# EAGLE design Electronic Sculpture PCB rev1 (EAGLE 9.6.2)
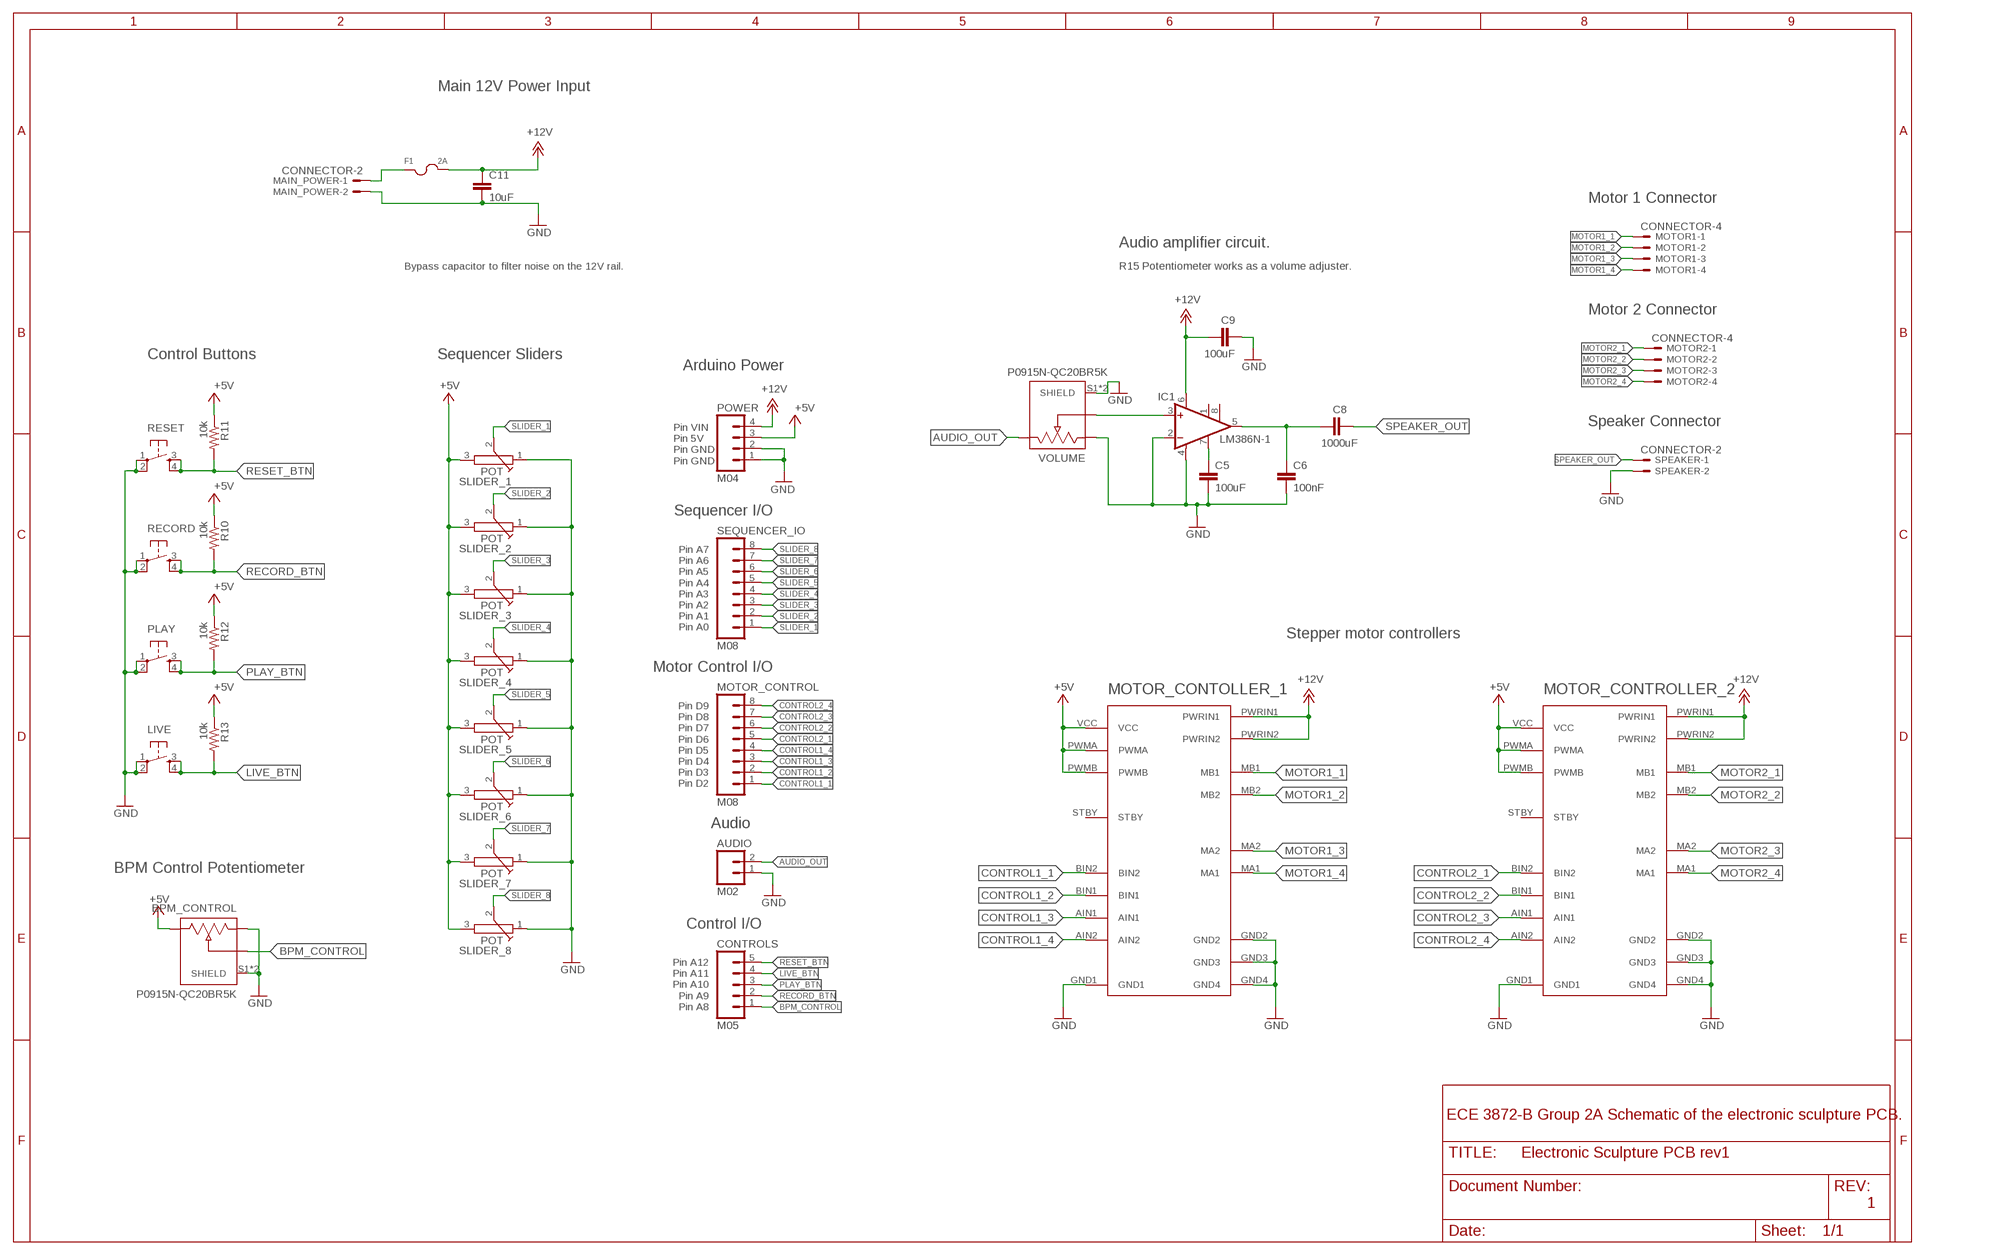
[diagram p0: schematic, sheet 1]

## Parts
AUDIO  M02  [1X02]
BPM_CONTROL  P0915N-QC20BR5K  [TRIM_P0915N-QC20BR5K]
C5  100uF  CAPPTH1  [CAP-PTH-5MM]
C6  100nF  CAPPTH1  [CAP-PTH-5MM]
C8  1000uF  CAPPTH1  [CAP-PTH-5MM]
C9  100uF  CAPPTH1  [CAP-PTH-5MM]
C11  10uF  CAPPTH1  [CAP-PTH-5MM]
CONTROLS  M05  [1X05]
F1  2A  FUSE_MINIBLADE  [MINI-BLADE_FUSE_HOLDER]
IC1  LM386N-1  [DIL08]
LIVE  BIG_PUSHBUTTON  [BIG_PUSHBUTTON]
MAIN_POWER  CONNECTOR-2  [MINIFIT_5566-2]
MOTOR1  CONNECTOR-4  [MINIFIT_5566-4]
MOTOR2  CONNECTOR-4  [MINIFIT_5566-4]
MOTOR_CONTOLLER_1  TB6612_BREAKOUT  [TB6612_BREAKOUT]
MOTOR_CONTROL  M08  [1X08]
MOTOR_CONTROLLER_2  TB6612_BREAKOUT  [TB6612_BREAKOUT]
PLAY  BIG_PUSHBUTTON  [BIG_PUSHBUTTON]
POWER  M04  [1X04]
R10  10k  RESISTORAXIAL-0.3  [AXIAL-0.3]
R11  10k  RESISTORAXIAL-0.3  [AXIAL-0.3]
R12  10k  RESISTORAXIAL-0.3  [AXIAL-0.3]
R13  10k  RESISTORAXIAL-0.3  [AXIAL-0.3]
RECORD  BIG_PUSHBUTTON  [BIG_PUSHBUTTON]
RESET  BIG_PUSHBUTTON  [BIG_PUSHBUTTON]
SEQUENCER_IO  M08  [1X08]
SLIDER_1  SLIDE_POT  [SLIDE_POT]
SLIDER_2  SLIDE_POT  [SLIDE_POT]
SLIDER_3  SLIDE_POT  [SLIDE_POT]
SLIDER_4  SLIDE_POT  [SLIDE_POT]
SLIDER_5  SLIDE_POT  [SLIDE_POT]
SLIDER_6  SLIDE_POT  [SLIDE_POT]
SLIDER_7  SLIDE_POT  [SLIDE_POT]
SLIDER_8  SLIDE_POT  [SLIDE_POT]
SPEAKER  CONNECTOR-2  [MINIFIT_5566-2]
VOLUME  P0915N-QC20BR5K  [TRIM_P0915N-QC20BR5K]

## Nets
+5V: BPM_CONTROL.3 MOTOR_CONTOLLER_1.PWMA MOTOR_CONTOLLER_1.PWMB MOTOR_CONTOLLER_1.VCC MOTOR_CONTROLLER_2.PWMA MOTOR_CONTROLLER_2.PWMB MOTOR_CONTROLLER_2.VCC POWER.3 R10.P$1 R11.P$1 R12.P$1 R13.P$1 SLIDER_1.3 SLIDER_2.3 SLIDER_3.3 SLIDER_4.3 SLIDER_5.3 SLIDER_6.3 SLIDER_7.3 SLIDER_8.3
+12V: C9.1 C11.1 F1.R1 F1.R2 IC1.6(VS) MOTOR_CONTOLLER_1.PWRIN1 MOTOR_CONTOLLER_1.PWRIN2 MOTOR_CONTROLLER_2.PWRIN1 MOTOR_CONTROLLER_2.PWRIN2 POWER.4
AUDIO_OUT: AUDIO.2 VOLUME.3
BPM_CONTROL: BPM_CONTROL.2 CONTROLS.1
CONTROL1_1: MOTOR_CONTOLLER_1.BIN2 MOTOR_CONTROL.1
CONTROL1_2: MOTOR_CONTOLLER_1.BIN1 MOTOR_CONTROL.2
CONTROL1_3: MOTOR_CONTOLLER_1.AIN1 MOTOR_CONTROL.3
CONTROL1_4: MOTOR_CONTOLLER_1.AIN2 MOTOR_CONTROL.4
CONTROL2_1: MOTOR_CONTROL.5 MOTOR_CONTROLLER_2.BIN2
CONTROL2_2: MOTOR_CONTROL.6 MOTOR_CONTROLLER_2.BIN1
CONTROL2_3: MOTOR_CONTROL.7 MOTOR_CONTROLLER_2.AIN1
CONTROL2_4: MOTOR_CONTROL.8 MOTOR_CONTROLLER_2.AIN2
GND: AUDIO.1 BPM_CONTROL.1 BPM_CONTROL.S1(SHIELD) BPM_CONTROL.S2(SHIELD) C5.2 C6.2 C9.2 C11.2 IC1.2(-IN) IC1.4(GND) LIVE.1(P) LIVE.2(P1) MAIN_POWER.2 MOTOR_CONTOLLER_1.GND1 MOTOR_CONTOLLER_1.GND2 MOTOR_CONTOLLER_1.GND3 MOTOR_CONTOLLER_1.GND4 MOTOR_CONTROLLER_2.GND1 MOTOR_CONTROLLER_2.GND2 MOTOR_CONTROLLER_2.GND3 MOTOR_CONTROLLER_2.GND4 PLAY.1(P) PLAY.2(P1) POWER.1 POWER.2 RECORD.1(P) RECORD.2(P1) RESET.1(P) RESET.2(P1) SLIDER_1.1 SLIDER_2.1 SLIDER_3.1 SLIDER_4.1 SLIDER_5.1 SLIDER_6.1 SLIDER_7.1 SLIDER_8.1 SPEAKER.2 VOLUME.1 VOLUME.S1(SHIELD) VOLUME.S2(SHIELD)
LIVE_BTN: CONTROLS.4 LIVE.3(S) LIVE.4(S1) R13.P$2
MOTOR1_1: MOTOR1.1 MOTOR_CONTOLLER_1.MB1
MOTOR1_2: MOTOR1.2 MOTOR_CONTOLLER_1.MB2
MOTOR1_3: MOTOR1.3 MOTOR_CONTOLLER_1.MA2
MOTOR1_4: MOTOR1.4 MOTOR_CONTOLLER_1.MA1
MOTOR2_1: MOTOR2.1 MOTOR_CONTROLLER_2.MB1
MOTOR2_2: MOTOR2.2 MOTOR_CONTROLLER_2.MB2
MOTOR2_3: MOTOR2.3 MOTOR_CONTROLLER_2.MA2
MOTOR2_4: MOTOR2.4 MOTOR_CONTROLLER_2.MA1
N$1: F1.L1 F1.L2 MAIN_POWER.1
N$2: C5.1 IC1.7(BYPASS)
N$3: IC1.3(+IN) VOLUME.2
N$4: C6.1 C8.1 IC1.5(OUT)
PLAY_BTN: CONTROLS.3 PLAY.3(S) PLAY.4(S1) R12.P$2
RECORD_BTN: CONTROLS.2 R10.P$2 RECORD.3(S) RECORD.4(S1)
RESET_BTN: CONTROLS.5 R11.P$2 RESET.3(S) RESET.4(S1)
SLIDER_1: SEQUENCER_IO.1 SLIDER_1.2
SLIDER_2: SEQUENCER_IO.2 SLIDER_2.2
SLIDER_3: SEQUENCER_IO.3 SLIDER_3.2
SLIDER_4: SEQUENCER_IO.4 SLIDER_4.2
SLIDER_5: SEQUENCER_IO.5 SLIDER_5.2
SLIDER_6: SEQUENCER_IO.6 SLIDER_6.2
SLIDER_7: SEQUENCER_IO.7 SLIDER_7.2
SLIDER_8: SEQUENCER_IO.8 SLIDER_8.2
SPEAKER_OUT: C8.2 SPEAKER.1
Unconnected: IC1.1(GAIN) IC1.8(GAIN) MOTOR_CONTOLLER_1.STBY MOTOR_CONTROLLER_2.STBY

## Notes on the sheet
- Main 12V Power Input
- Motor 1 Connector
- Audio amplifier circuit.
- Bypass capacitor to filter noise on the 12V rail. | R15 Potentiometer works as a volume adjuster.
- Motor 2 Connector
- Control Buttons | Sequencer Sliders
- Arduino Power
- Speaker Connector
- Pin VIN
  Pin 5V
  Pin GND
  Pin GND
- Sequencer I/O
- Pin A7
  Pin A6
  Pin A5
  Pin A4
  Pin A3
  Pin A2
  Pin A1
  Pin A0
- Stepper motor controllers
- Motor Control I/O
- Pin D9
  Pin D8
  Pin D7
  Pin D6
  Pin D5
  Pin D4
  Pin D3
  Pin D2
- Audio
- BPM Control Potentiometer
- Control I/O
- Pin A12
  Pin A11
  Pin A10
  Pin A9
  Pin A8
- ECE 3872-B Group 2A Schematic of the electronic sculpture PCB.
- 1

## Library data of the parts
AUDIO = HyTechDevices:M02: Standard 2-pin 0.1" header. NOTES ON THE VARIANTS LOCK and LOCK_LONGPADS... This footprint was designed to help hold the alignment of a through-hole component (i.e. 6-pin header) while soldering it into place. You may notice that each hole has been shifted either up or down by 0.005 of an inch from it's more standard position (which is a perfectly straight line). This slight alteration caused the pins (the squares in the middle) to touch the edges of the holes. Because they are alternating, it causes a "brace" to hold the component in place. 0.005 has proven to be the perfect amount of "off-center" position when using our standard breakaway headers. Although looks a little odd when you look at the bare footprint, once you have a header in there, the alteration is very hard to notice. Also,if you push a header all the way into place, it is covered up entirely on the bottom side. This idea of altering the position of holes to aid alignment will be further integrated into the Sparkfun Library for other footprints. It can help hold any component with 3 or more connection pins. Note: The Sparkfun version includes many other packages including surface mount that may be of future interest. Source: Sparkfun <https://github.com/sparkfun/SparkFun-Eagle-Libraries>
BPM_CONTROL VOLUME = 3872_Part_Library:P0915N-QC20BR5K: P09X Series 9 mm Side Adjustment 5 kOhm ±20 % Rotary Potentiometer; AVAILABILITY: Unavailable; DESCRIPTION: 5k Ohm 1 Gang Linear Panel Mount Potentiometer None 1 Kierros Conductive Plastic 0.05W, 1/20W PC Pins, Board Locks; MF: TT Electronics/BI; MP: P0915N-QC20BR5K; PACKAGE: None; PRICE: None
C5 C6 C8 C9 C11 = HyTechDevices:CAP: Capacitor Standard 0603 ceramic capacitor, and 0.1" leaded capacitor.
CONTROLS = HyTechDevices:M05: Standard 5-pin 0.1" header. NOTES ON THE VARIANTS LOCK and LOCK_LONGPADS... This footprint was designed to help hold the alignment of a through-hole component (i.e. 5-pin header) while soldering it into place. You may notice that each hole has been shifted either up or down by 0.005 of an inch from it's more standard position (which is a perfectly straight line). This slight alteration caused the pins (the squares in the middle) to touch the edges of the holes. Because they are alternating, it causes a "brace" to hold the component in place. 0.005 has proven to be the perfect amount of "off-center" position when using our standard breakaway headers. Although looks a little odd when you look at the bare footprint, once you have a header in there, the alteration is very hard to notice. Also,if you push a header all the way into place, it is covered up entirely on the bottom side. This idea of altering the position of holes to aid alignment will be further integrated into the Sparkfun Library for other footprints. It can help hold any component with 3 or more connection pins. Note: The Sparkfun version includes many other packages including surface mount that may be of future interest. Source: Sparkfun <https://github.com/sparkfun/SparkFun-Eagle-Libraries>
F1 = HyTechDevices:FUSE: Fuse/Fuseclips Keystone Electronics 3568 Fuse Mouser Part <http://www.mouser.com/ProductDetail/Keystone-Electronics/3568> Datasheet <http://www.mouser.com/ds/2/215/568-742601.pdf> Bussman/Eaton Midget Fuse Clip 1A3400 <http://www.mouser.com/ProductDetail/Bussmann-Eaton/BK-1A3400-09-R/?qs=sGAEpiMZZMuG%252bgnN5hGYGzzlAelq2OxnKqVSMVjq8I4%3d> Schurter 0751.0110 Brass Fuse Clip Datasheet <http://www.mouser.com/ds/2/358/typ_OG__Clip__5x20-2553.pdf> Bel Fuse 0ZCF Series Surface Mount PTC (resettable) Fuse Datasheet <https://belfuse.com/resources/CircuitProtection/datasheets/0ZCF%20Nov2016.pdf> Littelfuse 1812L Series Surface Mount PTC (resettable) Fuse Datasheet <https://m.littelfuse.com/~/media/electronics/datasheets/resettable_ptcs/littelfuse_ptc_1812l_datasheet.pdf.pdf>
IC1 = linear:LM386?-*: Low Voltage Audio Power Amplifier Source: http://cache.national.com/ds/LM/LM386.pdf
LIVE PLAY RECORD RESET = 3872_Part_Library:BIG_PUSHBUTTON: Big momentary pushbutton. Drawing & info. <https://www.sparkfun.com/datasheets/Components/Buttons/TSA12110%20TACT%20SWITCH.jpg>
MAIN_POWER SPEAKER = HyTechDevices:CONNECTOR-2: Mini-Fit Junior connector 2 pole Source: http://www.molex.com; OC_FARNELL: 1822072; OC_NEWARK: unknown
MOTOR1 MOTOR2 = HyTechDevices:CONNECTOR-4: Mini-Fit Junior connector 4 pole Source: http://www.molex.com; OC_FARNELL: unknown; OC_NEWARK: unknown
MOTOR_CONTOLLER_1 MOTOR_CONTROLLER_2 = 3872_Part_Library:TB6612_BREAKOUT: Adafruit TB6612 stepper motor controller breakout board. Info and datasheets. <https://www.adafruit.com/product/2448>
MOTOR_CONTROL SEQUENCER_IO = HyTechDevices:M08: Standard 8-pin 0.1" header. NOTES ON THE VARIANTS LOCK and LOCK_LONGPADS... This footprint was designed to help hold the alignment of a through-hole component (i.e. 6-pin header) while soldering it into place. You may notice that each hole has been shifted either up or down by 0.005 of an inch from it's more standard position (which is a perfectly straight line). This slight alteration caused the pins (the squares in the middle) to touch the edges of the holes. Because they are alternating, it causes a "brace" to hold the component in place. 0.005 has proven to be the perfect amount of "off-center" position when using our standard breakaway headers. Although looks a little odd when you look at the bare footprint, once you have a header in there, the alteration is very hard to notice. Also,if you push a header all the way into place, it is covered up entirely on the bottom side. This idea of altering the position of holes to aid alignment will be further integrated into the Sparkfun Library for other footprints. It can help hold any component with 3 or more connection pins. Note: The Sparkfun version includes many other packages including surface mount that may be of future interest. Source: Sparkfun <https://github.com/sparkfun/SparkFun-Eagle-Libraries>
POWER = HyTechDevices:M04: Standard 4-pin 0.1" header. NOTES ON THE VARIANTS LOCK and LOCK_LONGPADS... This footprint was designed to help hold the alignment of a through-hole component (i.e. 6-pin header) while soldering it into place. You may notice that each hole has been shifted either up or down by 0.005 of an inch from it's more standard position (which is a perfectly straight line). This slight alteration caused the pins (the squares in the middle) to touch the edges of the holes. Because they are alternating, it causes a "brace" to hold the component in place. 0.005 has proven to be the perfect amount of "off-center" position when using our standard breakaway headers. Although looks a little odd when you look at the bare footprint, once you have a header in there, the alteration is very hard to notice. Also,if you push a header all the way into place, it is covered up entirely on the bottom side. This idea of altering the position of holes to aid alignment will be further integrated into the Sparkfun Library for other footprints. It can help hold any component with 3 or more connection pins. Note: The Sparkfun version includes many other packages including surface mount that may be of future interest. Source: Sparkfun <https://github.com/sparkfun/SparkFun-Eagle-Libraries>
R10-R13 = HyTechDevices:RESISTOR: Resistor Basic schematic elements and footprints for 0603, 1206, and PTH resistors.
SLIDER_1-SLIDER_8 = 3872_Part_Library:SLIDE_POT

## Board
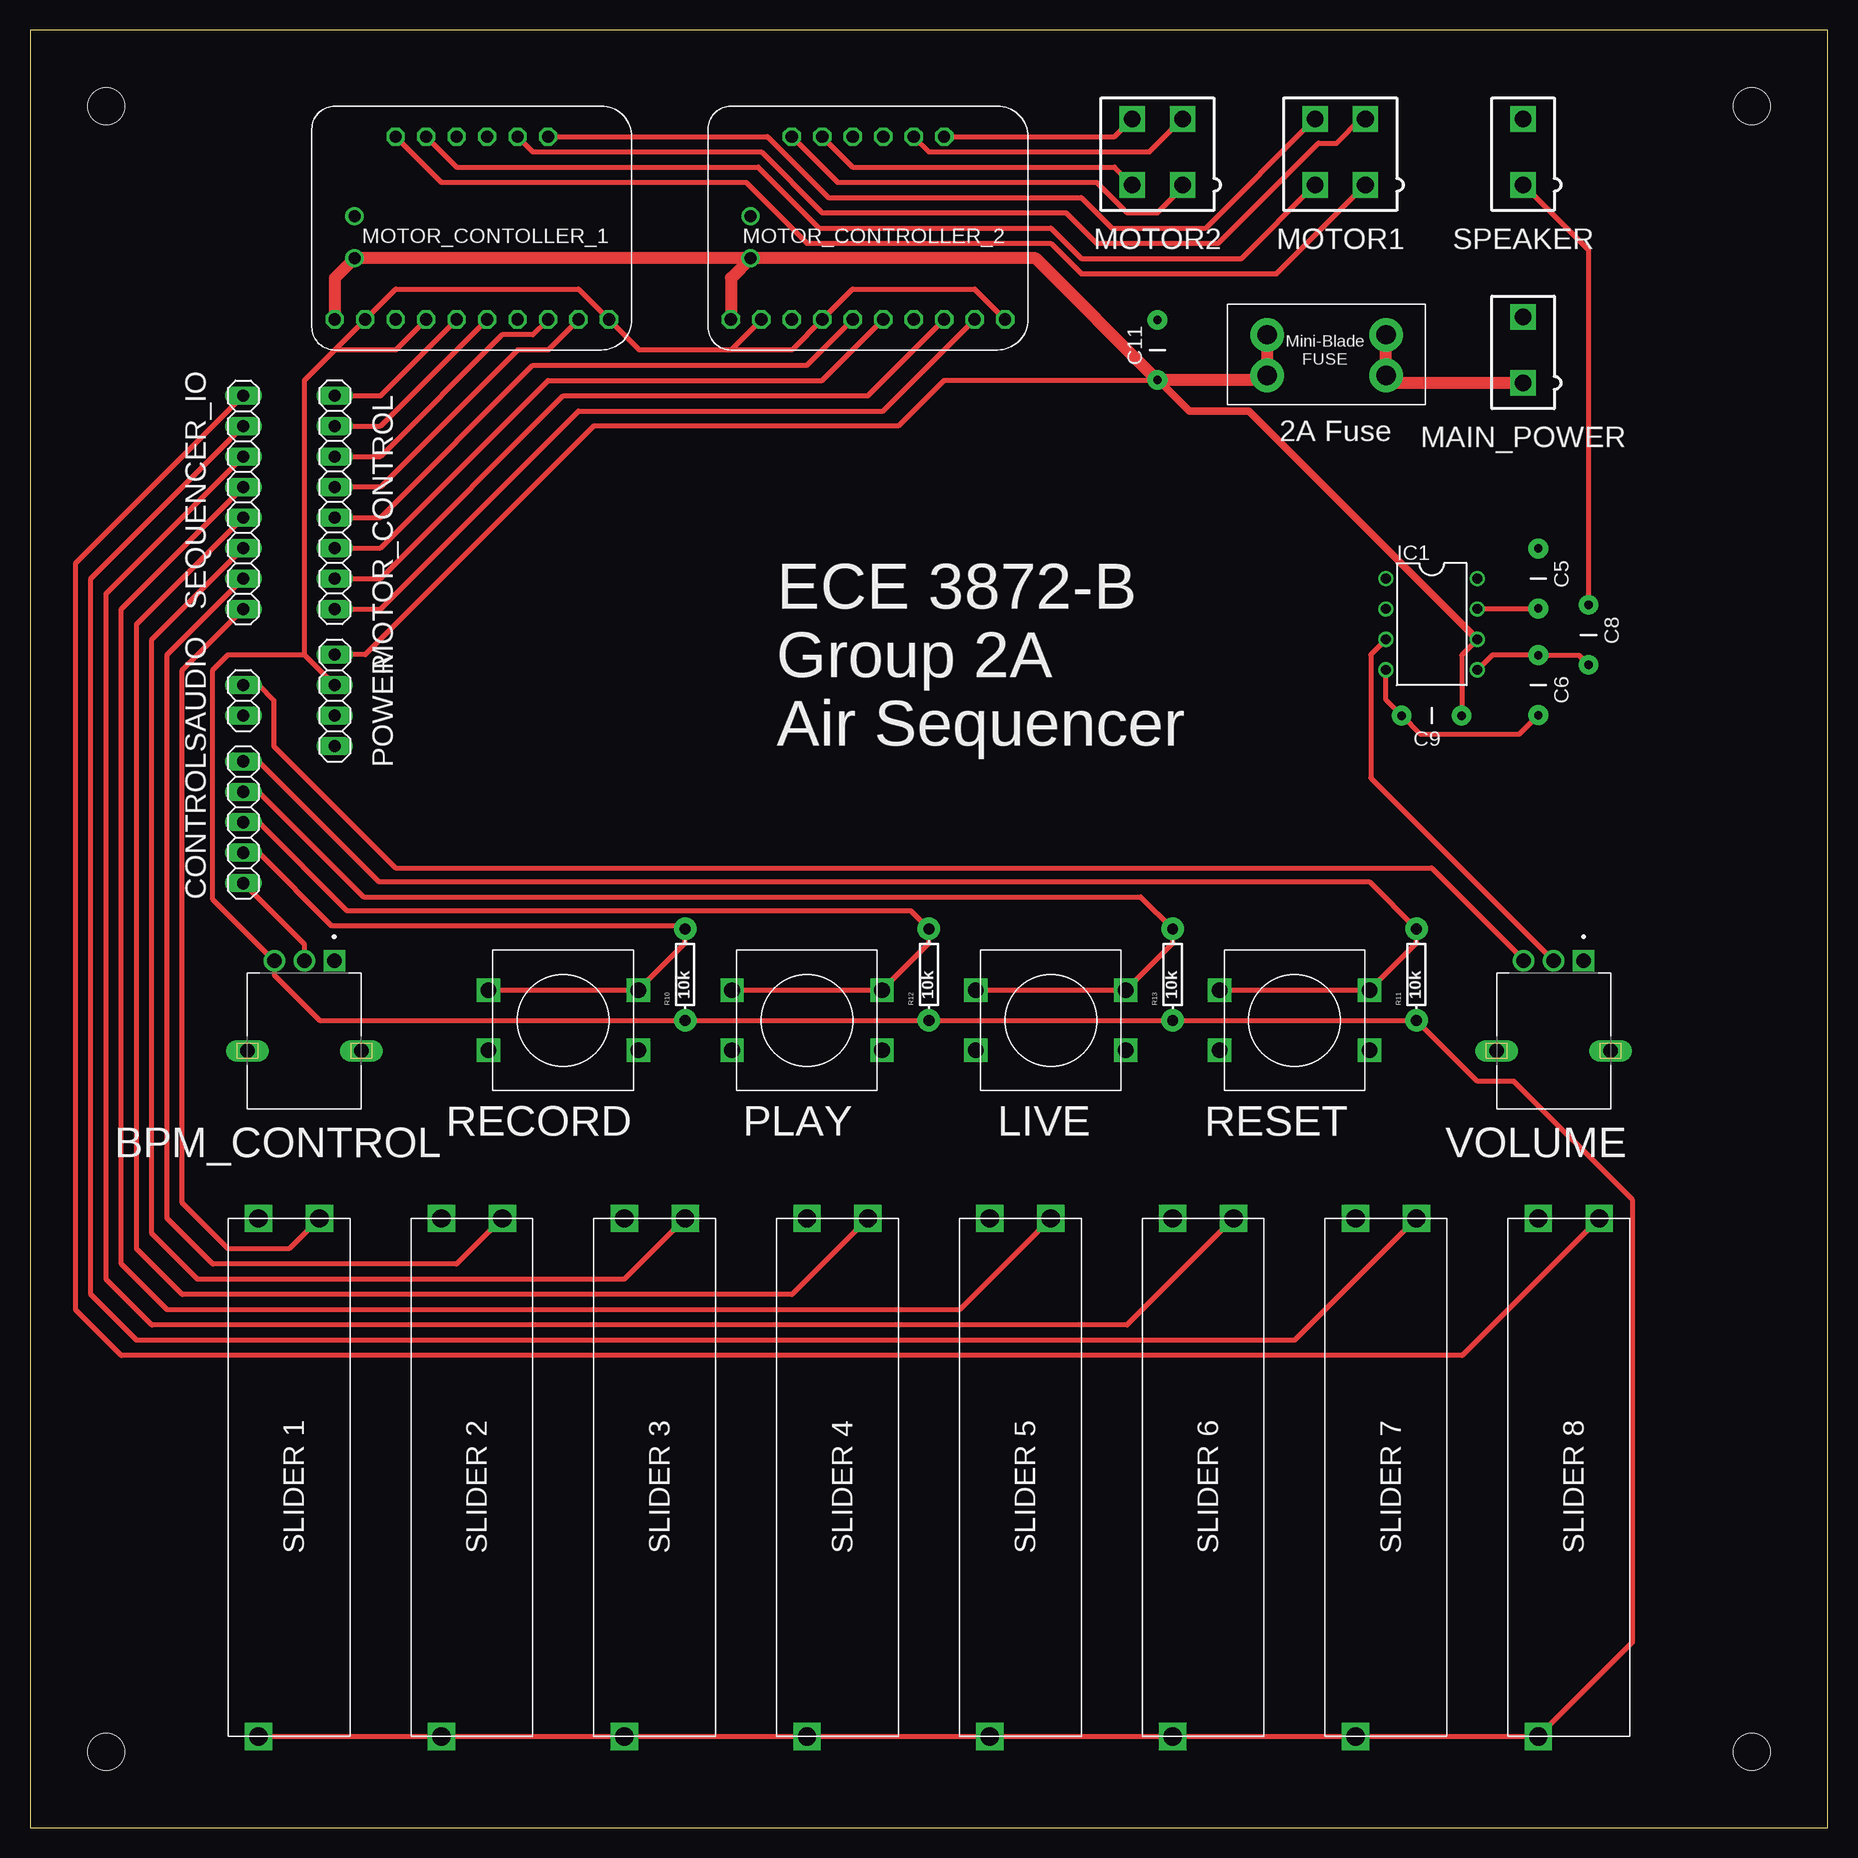
[diagram p1: board, top side]
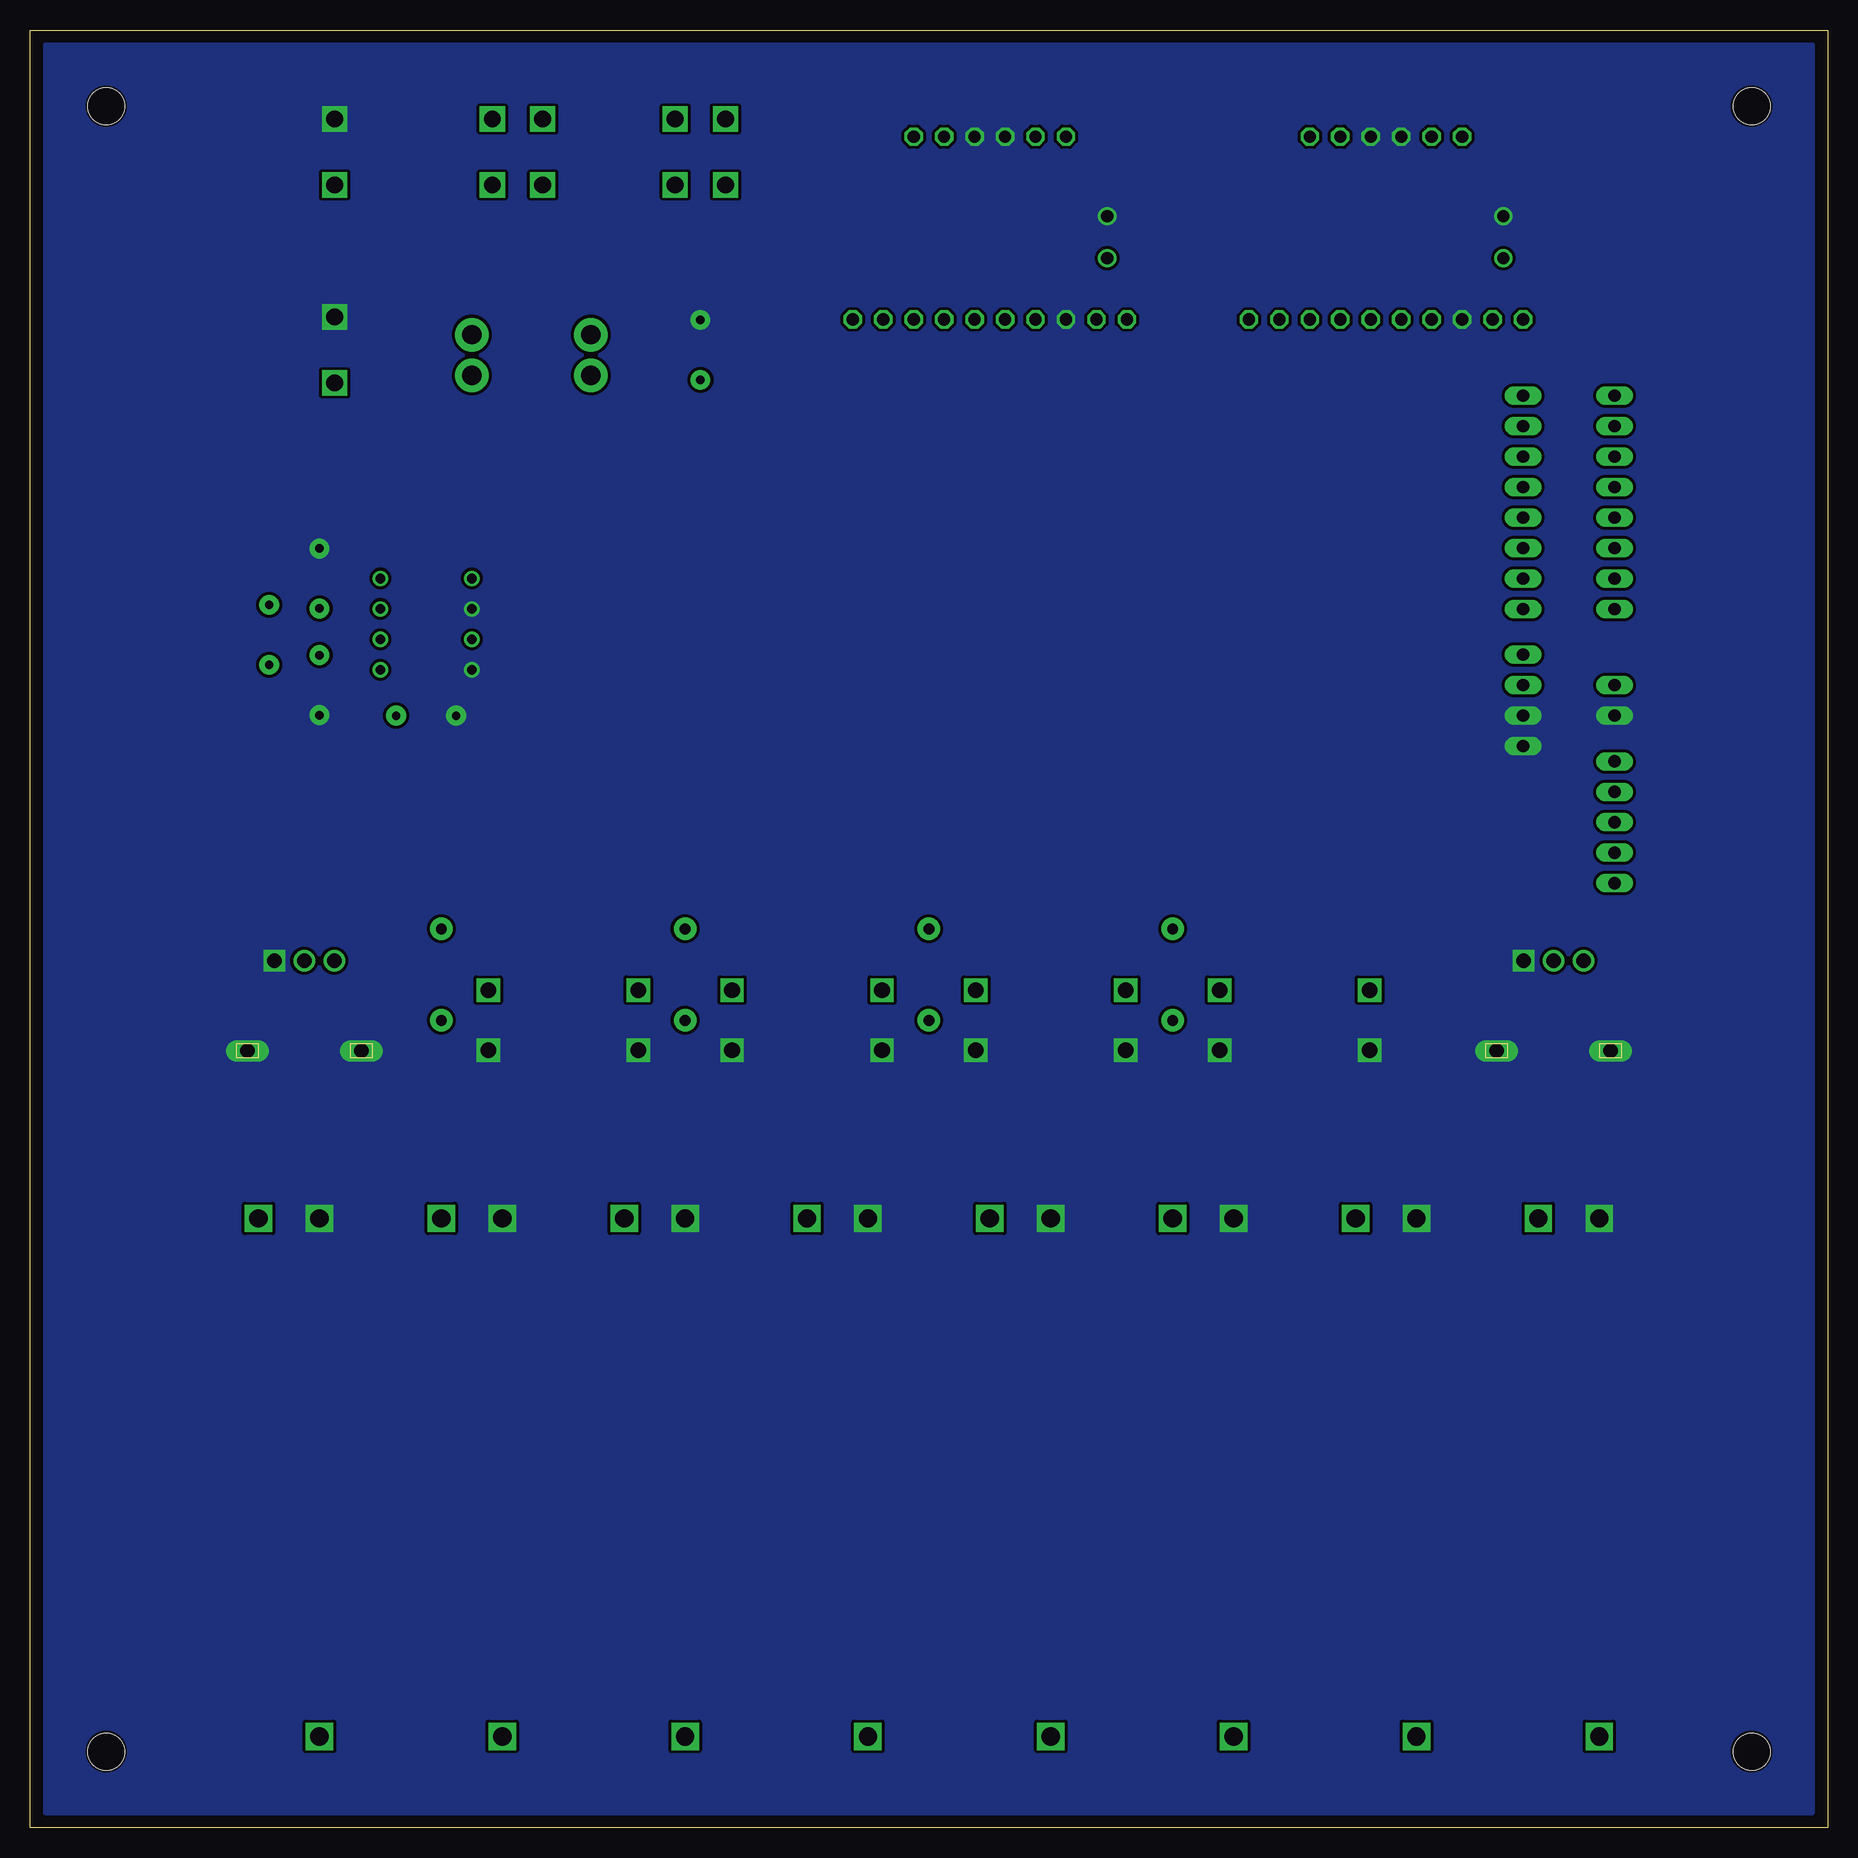
[diagram p2: board, bottom side, seen from below]

Size 149.86 x 149.86 mm. Coordinates in mm from the lower left corner, seen from the top.
Outline: 0,0 149.86,0 149.86,149.86 0,149.86 0,0
Copper layers (1*16): Top 0.035mm / dielectric 1.53mm / Bottom 0.035mm
Design rules "JLCPCB (2 Layer) *": minimum track width 5mil, minimum drill 0.3mm, track to track 10mil, track to pad 10mil, pad to pad 10mil, via to via 20mil, smd to smd 5mil, copper to edge 0.2mm, drill to drill 21mil, minimum pad ring 6mil, minimum via ring 6mil, stop-mask expansion 6mil, vias tented up to drill 30mil, thermal gap 10mil
Holes 3.05 mm at 6.35,6.35 6.35,143.51 143.51,6.35 143.51,143.51

### Footprints (pad centres in the part's own frame; a part is rotated, then mirrored left to right if it is on the bottom)
1X02 = drill 1.016 long: 1 -1.27,0; 2 1.27,0
TRIM_P0915N-QC20BR5K = drill 1.2 square: 1 -2.5,-5.725 | drill 1.2: 2 0,-5.725; 3 2.5,-5.725 | drill 1.2 long: S1 -4.75,1.775; S2 4.75,1.775
CAP-PTH-5MM = drill 0.7 pad 1.651: 1 -2.5,0; 2 2.5,0
1X05 = drill 1.016 long: 1 -5.08,0; 2 -2.54,0; 3 0,0; 4 2.54,0; 5 5.08,0
MINI-BLADE_FUSE_HOLDER = drill 1.613 pad 2.794: L1 0,3.404; L2 0,0; R1 9.906,3.404; R2 9.906,0
DIL08 = drill 0.813 pad 1.27: 1 -3.81,-3.81; 2 -1.27,-3.81; 3 1.27,-3.81; 4 3.81,-3.81; 5 3.81,3.81; 6 1.27,3.81; 7 -1.27,3.81; 8 -3.81,3.81
BIG_PUSHBUTTON = drill 1.3 square: 1 -6.248,2.489; 2 6.248,2.489; 3 -6.248,-2.515; 4 6.248,-2.515
MINIFIT_5566-2 = drill 1.4 square: 1 0,-2.75; 2 0,2.75
MINIFIT_5566-4 = drill 1.4 square: 1 2.1,-2.75; 2 -2.1,-2.75; 3 2.1,2.75; 4 -2.1,2.75
TB6612_BREAKOUT = drill 1.016 octagon: AIN1 2.54,7.62; AIN2 2.54,5.08; BIN1 2.54,12.7; BIN2 2.54,15.24; GND1 2.54,20.32; GND2 17.78,15.24; GND3 17.78,12.7; MA1 17.78,7.62; MA2 17.78,10.16; MB1 17.78,20.32; MB2 17.78,17.78; PWMA 2.54,2.54; PWMB 2.54,17.78; PWRIN2 2.54,25.4; STBY 2.54,10.16; VCC 2.54,22.86 | drill 1.016: GND4 11.151,23.749; PWRIN1 7.645,23.749
1X08 = drill 1.016 long: 1 -8.89,0; 2 -6.35,0; 3 -3.81,0; 4 -1.27,0; 5 1.27,0; 6 3.81,0; 7 6.35,0; 8 8.89,0
1X04 = drill 1.016 long: 1 -3.81,0; 2 -1.27,0; 3 1.27,0; 4 3.81,0
AXIAL-0.3 = drill 0.9 pad 1.88: P$1 -3.81,0; P$2 3.81,0
SLIDE_POT = drill 1.524 square: 1 0,0; 2 0,5.08; 3 43.18,0

### Placement (x,y rotation side)
AUDIO  17.78,93.98 90 top
BPM_CONTROL  22.86,66.55 180 top
C5  125.73,104.14 90 top
C6  125.73,95.25 270 top
C8  129.92,99.44 90 top
C9  116.84,92.71 180 top
C11  93.98,123.19 90 top
CONTROLS  17.78,83.82 90 top
F1  113.03,124.46 180 top
IC1  116.84,100.33 270 top
LIVE  85.09,67.31 180 top
MAIN_POWER  124.46,123.19 0 top
MOTOR1  109.22,139.7 0 top
MOTOR2  93.98,139.7 0 top
MOTOR_CONTOLLER_1  50.8,123.19 90 top
MOTOR_CONTROL  25.4,110.49 270 top
MOTOR_CONTROLLER_2  83.82,123.19 90 top
PLAY  64.77,67.31 180 top
POWER  25.4,93.98 90 top
R10  54.61,71.12 90 top
R11  115.57,71.12 90 top
R12  74.93,71.12 90 top
R13  95.25,71.12 90 top
RECORD  44.45,67.31 180 top
RESET  105.41,67.31 180 top
SEQUENCER_IO  17.78,110.49 90 top
SLIDER_1  19.05,50.8 270 top
SLIDER_2  34.29,50.8 270 top
SLIDER_3  49.53,50.8 270 top
SLIDER_4  64.77,50.8 270 top
SLIDER_5  80.01,50.8 270 top
SLIDER_6  95.25,50.8 270 top
SLIDER_7  110.49,50.8 270 top
SLIDER_8  125.73,50.8 270 top
SPEAKER  124.46,139.7 0 top
VOLUME  127,66.55 180 top

### Tracks (layer width: path | path; a pad name or v marks a point on that pad's centre or on a via)
+5V
  Top 0.406: 25.4,123.19 MOTOR_CONTOLLER_1.VCC 30.48,128.27 45.72,128.27 MOTOR_CONTOLLER_1.PWMA 50.8,123.19 58.42,123.19 | 25.4,123.19 22.86,120.65 22.86,97.79 | MOTOR_CONTROLLER_2.VCC 58.42,123.19 | 58.42,123.19 63.5,123.19 MOTOR_CONTROLLER_2.PWMB 68.58,128.27 78.74,128.27 MOTOR_CONTROLLER_2.PWMA | MOTOR_CONTOLLER_1.PWMB 30.48,123.19 25.4,123.19 | 22.86,97.79 POWER.3 | 22.86,97.79 16.51,97.79 15.24,96.52 15.24,77.39 BPM_CONTROL.3 20.36,71.08 24.13,67.31 R10.P$1 R12.P$1 R13.P$1 R11.P$1 120.65,62.23 123.7,62.23 133.6,52.32 133.6,15.49 SLIDER_8.3 SLIDER_7.3 SLIDER_6.3 SLIDER_5.3 SLIDER_4.3 SLIDER_3.3 SLIDER_2.3 SLIDER_1.3
+12V
  Top 0.406: IC1.6 119.34,97.75 C9.1 | C11.1 93.94,120.65 76.2,120.65 72.39,116.84 46.99,116.84 27.94,97.79 POWER.4
  Top 0.61: IC1.6 101.6,118.11 96.65,118.11 94.07,120.69 C11.1
  Top 1.016: F1.R2 F1.R1 102.76,120.69 C11.1 83.83,130.84 MOTOR_CONTROLLER_2.PWRIN1 | MOTOR_CONTROLLER_2.PWRIN1 MOTOR_CONTOLLER_1.PWRIN1 25.4,129.18 MOTOR_CONTOLLER_1.PWRIN2 | MOTOR_CONTROLLER_2.PWRIN1 58.42,129.18 MOTOR_CONTROLLER_2.PWRIN2
AUDIO_OUT
  Top 0.406: VOLUME.3 124.5,72.35 116.84,80.01 30.48,80.01 20.32,90.17 20.32,93.98 19.05,95.25 AUDIO.2
BPM_CONTROL
  Top 0.406: CONTROLS.1 22.86,73.66 BPM_CONTROL.2
CONTROL1_1
  Top 0.406: MOTOR_CONTROL.1 29.21,119.38 MOTOR_CONTOLLER_1.BIN2
CONTROL1_2
  Top 0.406: MOTOR_CONTROL.2 29.21,116.84 MOTOR_CONTOLLER_1.BIN1
CONTROL1_3
  Top 0.406: MOTOR_CONTOLLER_1.AIN1 41.91,124.46 39.37,124.46 29.21,114.3 MOTOR_CONTROL.3
CONTROL1_4
  Top 0.406: MOTOR_CONTOLLER_1.AIN2 43.18,123.19 40.64,123.19 29.21,111.76 MOTOR_CONTROL.4
CONTROL2_1
  Top 0.406: MOTOR_CONTROL.5 29.21,109.22 41.91,121.92 64.77,121.92 MOTOR_CONTROLLER_2.BIN2
CONTROL2_2
  Top 0.406: MOTOR_CONTROL.6 29.21,106.68 43.18,120.65 66.04,120.65 MOTOR_CONTROLLER_2.BIN1
CONTROL2_3
  Top 0.406: MOTOR_CONTROL.7 29.21,104.14 44.45,119.38 69.85,119.38 MOTOR_CONTROLLER_2.AIN1
CONTROL2_4
  Top 0.406: MOTOR_CONTROL.8 29.21,101.6 45.72,118.11 71.12,118.11 MOTOR_CONTROLLER_2.AIN2
GND
  Top 0.406: IC1.4 113.03,94.02 C9.2 115.86,91.19 124.17,91.19 C6.2
  pour Bottom (no thermals): 1.27,148.59 147.32,148.59 148.59,148.59 148.59,1.27 1.27,1.27
LIVE_BTN
  Top 0.406: LIVE.4 LIVE.3 95.25,73.74 R13.P$2 92.58,77.6 27.81,77.6 19.05,86.36 CONTROLS.4
MOTOR1_1
  Top 0.406: MOTOR_CONTOLLER_1.MB1 34.29,137.16 59.69,137.16 64.77,132.08 85.09,132.08 87.63,129.54 103.91,129.54 MOTOR1.1
MOTOR1_2
  Top 0.406: MOTOR_CONTOLLER_1.MB2 35.56,138.43 60.71,138.43 65.79,133.35 85.09,133.35 87.63,130.81 100.98,130.81 MOTOR1.2
MOTOR1_3
  Top 0.406: MOTOR_CONTOLLER_1.MA2 41.91,139.7 60.96,139.7 66.04,134.62 86.36,134.62 88.9,132.08 99.06,132.08 107.42,140.44 108.94,140.44 110.96,142.45 MOTOR1.3
MOTOR1_4
  Top 0.406: MOTOR_CONTOLLER_1.MA1 61.47,140.97 66.55,135.89 87.63,135.89 90.17,133.35 98.02,133.35 MOTOR1.4
MOTOR2_1
  Top 0.406: MOTOR_CONTROLLER_2.MB1 67.31,137.16 88.9,137.16 91.44,134.62 93.98,134.62 96.08,136.72 MOTOR2.1
MOTOR2_2
  Top 0.406: MOTOR_CONTROLLER_2.MB2 68.58,138.43 90.4,138.43 MOTOR2.2
MOTOR2_3
  Top 0.406: MOTOR_CONTROLLER_2.MA2 74.93,139.7 93.33,139.7 MOTOR2.3
MOTOR2_4
  Top 0.406: MOTOR2.4 90.4,140.97 MOTOR_CONTROLLER_2.MA1
N$1
  Top 1.016: MAIN_POWER.1 113.65,120.44 F1.L1 F1.L2
N$2
  Top 0.406: C5.1 125.69,101.6 IC1.7
N$3
  Top 0.406: IC1.3 111.76,97.79 111.76,87.51 VOLUME.2
N$4
  Top 0.406: IC1.5 121.88,97.75 C6.1 129.11,97.75 C8.1
PLAY_BTN
  Top 0.406: PLAY.4 58.55,69.85 71.12,69.85 71.09,69.83 PLAY.3 74.93,73.74 R12.P$2 73.41,76.45 26.42,76.45 19.05,83.82 CONTROLS.3
RECORD_BTN
  Top 0.406: RECORD.4 RECORD.3 54.61,73.74 R10.P$2 54.36,75.18 25.15,75.18 19.05,81.28 CONTROLS.2
RESET_BTN
  Top 0.406: RESET.4 RESET.3 115.57,73.74 R11.P$2 111.63,78.87 29.08,78.87 19.05,88.9 CONTROLS.5
SLIDER_1
  Top 0.406: SLIDER_1.2 21.59,48.26 16.51,48.26 12.7,52.07 12.7,96.52 SEQUENCER_IO.1
SLIDER_2
  Top 0.406: SLIDER_2.2 35.56,46.99 15.24,46.99 11.43,50.8 11.43,97.79 SEQUENCER_IO.2
SLIDER_3
  Top 0.406: SLIDER_3.2 49.53,45.72 13.97,45.72 10.16,49.53 10.16,99.06 SEQUENCER_IO.3
SLIDER_4
  Top 0.406: SLIDER_4.2 63.5,44.45 12.7,44.45 8.89,48.26 8.89,100.33 SEQUENCER_IO.4
SLIDER_5
  Top 0.406: SLIDER_5.2 77.47,43.18 11.43,43.18 7.62,46.99 7.62,101.6 SEQUENCER_IO.5
SLIDER_6
  Top 0.406: SLIDER_6.2 91.44,41.91 10.16,41.91 6.35,45.72 6.35,102.87 SEQUENCER_IO.6
SLIDER_7
  Top 0.406: SLIDER_7.2 105.41,40.64 8.89,40.64 5.08,44.45 5.08,104.14 SEQUENCER_IO.7
SLIDER_8
  Top 0.406: SLIDER_8.2 119.38,39.37 7.62,39.37 3.81,43.18 3.81,105.41 SEQUENCER_IO.8
SPEAKER_OUT
  Top 0.406: C8.2 129.92,131.49 SPEAKER.1

### Text on the board
tPlace: 2A Fuse | ECE 3872-B / Group 2A / Air Sequencer | SLIDER 1 | SLIDER 2 | SLIDER 3 | SLIDER 4 | SLIDER 5 | SLIDER 6 | SLIDER 7 | SLIDER 8